# Altium project PCB_Project.PrjPcb
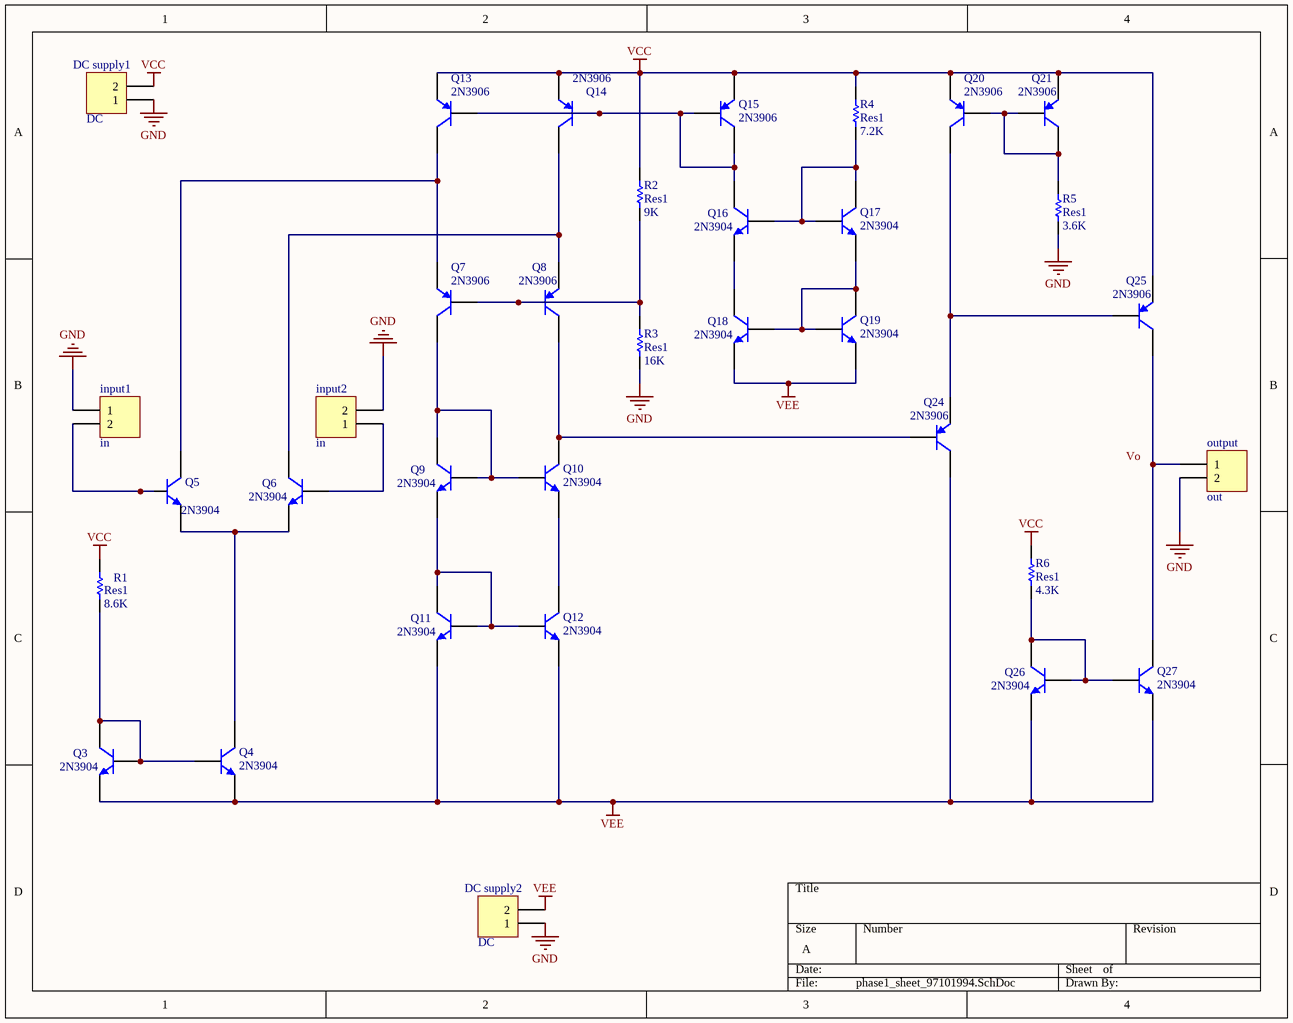
[diagram p0: phase1_sheet_97101994.SchDoc]
1 sheet, 34 parts. Net scope: global (net labels, ports and power ports of the same name join across sheets).
Board file: PCB1.PcbDoc

## Sheet phase1_sheet_97101994.SchDoc
size A

### Parts
DC_supply1  DC  [HDR1X2]
DC_supply2  DC  [HDR1X2]
input1  in  [HDR1X2]
input2  in  [HDR1X2]
output  out  [HDR1X2]
Q3  2N3904  [TO-92A]
Q4  2N3904  [TO-92A]
Q5  2N3904  [TO-92A]
Q6  2N3904  [TO-92A]
Q7  2N3906  [TO-92A]
Q8  2N3906  [TO-92A]
Q9  2N3904  [TO-92A]
Q10  2N3904  [TO-92A]
Q11  2N3904  [TO-92A]
Q12  2N3904  [TO-92A]
Q13  2N3906  [TO-92A]
Q14  2N3906  [TO-92A]
Q15  2N3906  [TO-92A]
Q16  2N3904  [TO-92A]
Q17  2N3904  [TO-92A]
Q18  2N3904  [TO-92A]
Q19  2N3904  [TO-92A]
Q20  2N3906  [TO-92A]
Q21  2N3906  [TO-92A]
Q24  2N3906  [TO-92A]
Q25  2N3906  [TO-92A]
Q26  2N3904  [TO-92A]
Q27  2N3904  [TO-92A]
R1  Res1  value 8.6K  [AXIAL-0.3]
R2  Res1  value 9K  [AXIAL-0.3]
R3  Res1  value 16K  [AXIAL-0.3]
R4  Res1  value 7.2K  [AXIAL-0.3]
R5  Res1  value 3.6K  [AXIAL-0.3]
R6  Res1  value 4.3K  [AXIAL-0.3]

### Nets
GND: DC_supply1.1 DC_supply2.1 input1.1 input2.2 output.2 R3.1 R5.1
VCC: DC_supply1.2 Q13.1(E) Q14.1(E) Q15.1(E) Q20.1(E) Q21.1(E) Q25.1(E) R1.2 R2.2 R4.2 R6.2
VEE: DC_supply2.2 Q3.1(E) Q4.1(E) Q11.1(E) Q12.1(E) Q18.1(E) Q19.1(E) Q24.3(C) Q26.1(E) Q27.1(E)
Netinput1_2: input1.2 Q5.2(B)
Netinput2_1: input2.1 Q6.2(B)
Netoutput_1: output.1 Q25.3(C) Q27.3(C)
NetQ3_2: Q3.2(B) Q3.3(C) Q4.2(B) R1.1
NetQ4_3: Q4.3(C) Q5.1(E) Q6.1(E)
NetQ5_3: Q5.3(C) Q7.1(E) Q13.3(C)
NetQ6_3: Q6.3(C) Q8.1(E) Q14.3(C)
NetQ7_2: Q7.2(B) Q8.2(B) R2.1 R3.2
NetQ7_3: Q7.3(C) Q9.2(B) Q9.3(C) Q10.2(B)
NetQ8_3: Q8.3(C) Q10.3(C) Q24.2(B)
NetQ9_1: Q9.1(E) Q11.2(B) Q11.3(C) Q12.2(B)
NetQ10_1: Q10.1(E) Q12.3(C)
NetQ13_2: Q13.2(B) Q14.2(B) Q15.2(B) Q15.3(C) Q16.3(C)
NetQ16_1: Q16.1(E) Q18.3(C)
NetQ16_2: Q16.2(B) Q17.2(B) Q17.3(C) R4.1
NetQ17_1: Q17.1(E) Q18.2(B) Q19.2(B) Q19.3(C)
NetQ20_2: Q20.2(B) Q21.2(B) Q21.3(C) R5.2
NetQ20_3: Q20.3(C) Q24.1(E) Q25.2(B)
NetQ26_2: Q26.2(B) Q26.3(C) Q27.2(B) R6.1

### Notes on the sheet
- Labels drawn without touching a wire or pin: Vo

### Library data of the parts
DC_supply1 DC_supply2 input1 input2 output = Header 2: Header, 2-Pin; LatestRevisionDate: 17-Jul-2002; LatestRevisionNote: Re-released for DXP Platform.; Publisher: Altium Limited
Q3-Q6 Q9-Q12 Q16-Q19 Q26 Q27 = 2N3904: NPN General Purpose Amplifier; Published: 8-Jun-2000; LatestRevisionDate: 15-Jan-2003; LatestRevisionNote: PCB Footprint 'BCY-W3/D4.7' replaced; DatasheetVersion: 1997; PackageVersion: Sep-1998; PackageReference: TO-92A; Publisher: Altium Limited; PackageDescription: TO, Flat Index; 3 In-Line, Axial Leads; Body Dia. 4.5mm; Leads 0.51 x 0.48 mm (max); ComponentLink1Description: Manufacturer Link; ComponentLink1URL: http://www.fairchildsemi.com/; ComponentLink2Description: Datasheet; ComponentLink2URL: http://www.fairchildsemi.com/ds/2N%2F2N3904.pdf
Q7 Q8 Q13-Q15 Q20 Q21 Q24 Q25 = 2N3906: PNP General Purpose Amplifier; Published: 8-Jun-2000; LatestRevisionDate: 15-Jan-2003; LatestRevisionNote: PCB Footprint 'BCY-W3/D4.7' replaced; DatasheetVersion: 1997; PackageVersion: Sep-1998; PackageReference: TO-92A; Publisher: Altium Limited; PackageDescription: TO, Flat Index; 3 In-Line, Axial Leads; Body Dia. 4.5mm; Leads 0.51 x 0.48 mm (max); ComponentLink1Description: Manufacturer Link; ComponentLink1URL: http://www.fairchildsemi.com/; ComponentLink2Description: Datasheet; ComponentLink2URL: http://www.fairchildsemi.com/ds/2N%2F2N3906.pdf
R1-R6 = Res1: Resistor; Published: 8-Jun-2000; LatestRevisionDate: 17-Jul-2002; LatestRevisionNote: Re-released for DXP Platform.; PackageReference: AXIAL-0.3; Publisher: Altium Limited; PackageDescription: Axial Device, Thru-Hole; 2 Leads; 0.3 in Pin Spacing